# Altium schematic sheet USB.SchDoc: USB-UART & FIFO bridge
size A3; CheckedBy: T.Janicki; CompanyName: Creotech Instruments SA; DrawnBy: Greg Kasprowicz; Organization: CERN; Address1: European Organization for Nuclear Research; Address2: CH-1211 Genève 23 - Switzerland; DocumentNumber: 17; Revision: -; SheetNumber: 17; SheetTotal: 17; EDA_Number: EDA-xxxx; Projet: Simple VME FMC Carrier; CreateDate: 20/11/2012; CheckedDate: 23/01/2012; DivGrp: BE-CO; Designer: G.Kasprowicz; ModifiedDate: -
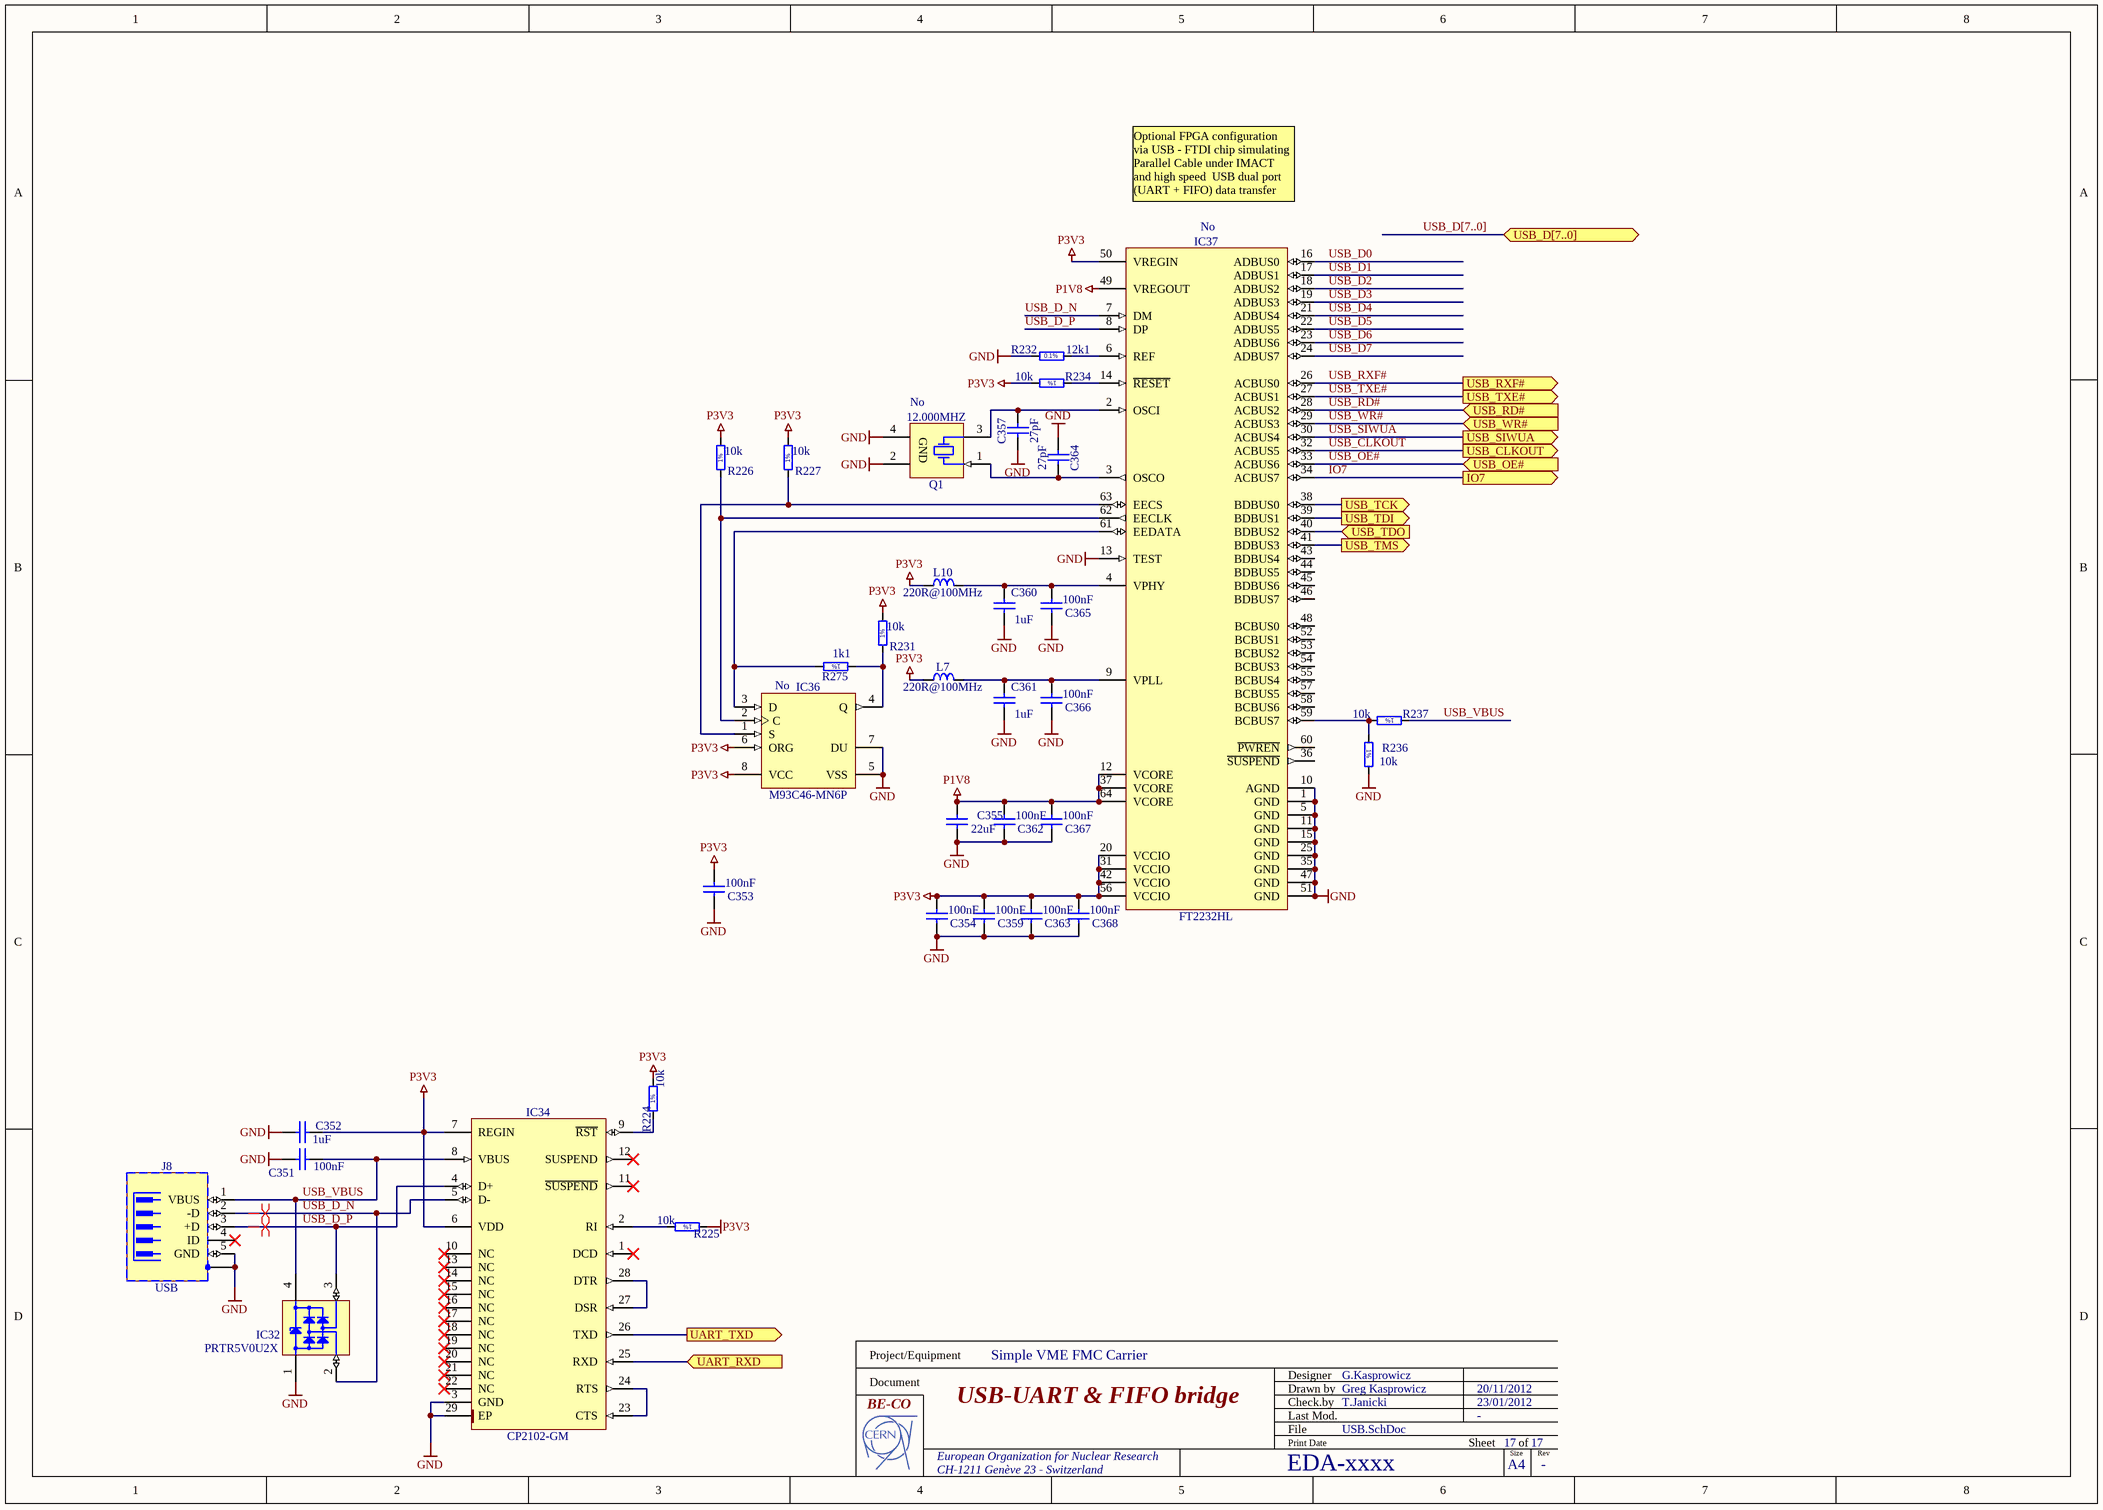
[diagram p0: USB.SchDoc]

## Parts
C351  100nF  [CAPC1005X55N]
C352  1uF  [CAPC1608X87N]
C353  100nF  [CAPC1005X55N]
C354  100nF  [CAPC1005X55N]
C355  22uF  [CAPC3216X180N]
C357  27pF  [CAPC1608X87N]
C359  100nF  [CAPC1005X55N]
C360  1uF  [CAPC1608X87N]
C361  1uF  [CAPC1608X87N]
C362  100nF  [CAPC1005X55N]
C363  100nF  [CAPC1005X55N]
C364  27pF  [CAPC1608X87N]
C365  100nF  [CAPC1005X55N]
C366  100nF  [CAPC1005X55N]
C367  100nF  [CAPC1005X55N]
C368  100nF  [CAPC1005X55N]
IC32  PRTR5V0U2X  [SOT190P230X110-4N]
IC34  CP2102-GM  [QFN50P500X500X100-29N-S335]
IC36  M93C46-MN6P  Mounted: No  [SOIC127P600X175-8N]
IC37  FT2232HL  Mounted: No  [QFP50P1200X1200X160-64N]
J8  USB  [TYCO_1734035-1]
L7  220R@100MHz  [INDC2012X105N]
L10  220R@100MHz  [INDC2012X105N]
Q1  12.000MHZ  Mounted: No  [XTAL_ABRACON_ABM3B]
R224  10k  [RESC1608X55N]
R225  10k  [RESC1608X55N]
R226  10k  [RESC1608X55N]
R227  10k  [RESC1608X55N]
R231  10k  [RESC1608X55N]
R232  12k1  [RESC1608X55N]
R234  10k  [RESC1608X55N]
R236  10k  [RESC1608X55N]
R237  10k  [RESC1608X55N]
R275  1k1  [RESC1608X55N]

## Ports
IO7 (out), UART_RXD (in), UART_TXD (out), USB_CLKOUT (out), USB_D[7..0] (bidir), USB_OE# (in), USB_RD# (in), USB_RXF# (out), USB_SIWUA (out), USB_TCK (out), USB_TDI (out), USB_TDO (in), USB_TMS (out), USB_TXE# (out), USB_WR# (in)

## Nets
GND: C351.2 C352.2 C353.2 C354.2 C355.1 C357.1 C359.2 C360.1 C361.1 C362.2 C363.2 C364.1 C365.2 C366.2 C367.2 C368.2 IC32.1(GND) IC34.3(GND) IC34.29(EP) IC36.5(VSS) IC36.7(DU) IC37.1(GND) IC37.5(GND) IC37.10(AGND) IC37.11(GND) IC37.13(TEST) IC37.15(GND) IC37.25(GND) IC37.35(GND) IC37.47(GND) IC37.51(GND) J8.5(GND) J8.6(SH) Q1.2(GND) Q1.4(GND) R232.1 R236.2
P1V8: C355.2 C362.1 C367.1 IC37.12(VCORE) IC37.37(VCORE) IC37.49(VREGOUT) IC37.64(VCORE)
P3V3: C352.1 C353.1 C354.1 C359.1 C363.1 C368.1 IC34.6(VDD) IC34.7(REGIN) IC36.6(ORG) IC36.8(VCC) IC37.20(VCCIO) IC37.31(VCCIO) IC37.42(VCCIO) IC37.50(VREGIN) IC37.56(VCCIO) L7.1 L10.1 R224.2 R225.1 R226.2 R227.2 R231.2 R234.2
IO7: IC37.34(ACBUS7) ; port IO7
UART_RXD: IC34.25(RXD) ; port UART_RXD
UART_TXD: IC34.26(TXD) ; port UART_TXD
USB_CLKOUT: IC37.32(ACBUS5) ; port USB_CLKOUT
USB_D0: IC37.16(ADBUS0)
USB_D1: IC37.17(ADBUS1)
USB_D2: IC37.18(ADBUS2)
USB_D3: IC37.19(ADBUS3)
USB_D4: IC37.21(ADBUS4)
USB_D5: IC37.22(ADBUS5)
USB_D6: IC37.23(ADBUS6)
USB_D7: IC37.24(ADBUS7)
USB_D_N: IC32.2(I/O1) IC34.5(D-) IC37.7(DM) J8.2(-D)
USB_D_P: IC32.3(I/O2) IC34.4(D+) IC37.8(DP) J8.3(+D)
USB_OE#: IC37.33(ACBUS6) ; port USB_OE#
USB_RD#: IC37.28(ACBUS2) ; port USB_RD#
USB_RXF#: IC37.26(ACBUS0) ; port USB_RXF#
USB_SIWUA: IC37.30(ACBUS4) ; port USB_SIWUA
USB_TCK: IC37.38(BDBUS0) ; port USB_TCK
USB_TDI: IC37.39(BDBUS1) ; port USB_TDI
USB_TDO: IC37.40(BDBUS2) ; port USB_TDO
USB_TMS: IC37.41(BDBUS3) ; port USB_TMS
USB_TXE#: IC37.27(ACBUS1) ; port USB_TXE#
USB_VBUS: C351.1 IC32.4(VCC) IC34.8(VBUS) J8.1(VBUS) R237.1
USB_WR#: IC37.29(ACBUS3) ; port USB_WR#
NetC357_2: C357.2 IC37.2(OSCI) Q1.3(X)
NetC360_2: C360.2 C365.1 IC37.4(VPHY) L10.2
NetC361_2: C361.2 C366.1 IC37.9(VPLL) L7.2
NetC364_2: C364.2 IC37.3(OSCO) Q1.1(X)
NetIC34_2: IC34.2(RI) R225.2
NetIC34_9: IC34.9(~{RST}) R224.1
NetIC34_23: IC34.23(CTS) IC34.24(RTS)
NetIC34_27: IC34.27(DSR) IC34.28(DTR)
NetIC36_1: IC36.1(S) IC37.63(EECS) R227.1
NetIC36_2: IC36.2(C) IC37.62(EECLK) R226.1
NetIC36_3: IC36.3(D) IC37.61(EEDATA) R275.2
NetIC36_4: IC36.4(Q) R231.1 R275.1
NetIC37_6: IC37.6(REF) R232.2
NetIC37_14: IC37.14(~{RESET}) R234.1
NetIC37_59: IC37.59(BCBUS7) R236.1 R237.2

Not connected (* = marked no-connect by the designer): IC34 1(DCD)* 10(NC)* 11(~{SUSPEND})* 12(SUSPEND)* 13(NC)* 14(NC)* 15(NC)* 16(NC)* 17(NC)* 18(NC)* 19(NC)* 20(NC)* 21(NC)* 22(NC)*; IC37 36(~{SUSPEND}) 43(BDBUS4) 44(BDBUS5) 45(BDBUS6) 46(BDBUS7) 48(BCBUS0) 52(BCBUS1) 53(BCBUS2) 54(BCBUS3) 55(BCBUS4) 57(BCBUS5) 58(BCBUS6) 60(~{PWREN}); J8 4(ID)*

## Buses and harness runs
bus USB_D[7..0] = port USB_D[7..0]

## Layout directives
differential pair: USB_D_N, USB_D_P

## Notes on the sheet
- Optional FPGA configuration via USB - FTDI chip simulating Parallel Cable under IMACT and high speed  USB dual port (UART + FIFO) data transfer port
- Project/Equipment
- Document
- Designer
- Drawn by
- Check.by
- File
- Last Mod.
- Print Date
- Sheet
- Size
- A4
- of
- Rev
- (in symbol R0603_1K1_1%_0.1W_100PPM) 1%
- (in symbol R0603_10K_1%_0.1W_100PPM) 1%
- (in symbol R0603_12K1_0.1%_0.063W_10PPM) 0.1%

## Library data of the parts
C351 C353 C354 C359 C362 C363 C365-C368 = CC0402_100NF_16V_10%_X7R: Non-polarised capacitor; Part Description: SMD Multilayer Chip Ceramic Capacitor; Manufacturer: GENERIC; Manufacturer1 Part Number: 223878715649; Voltage: 16V; TC: X7R; Tolerance: ±10%; Table: Capacitors SMD; Part Number: CC0402_100NF_16V_10%_X7R; Component Kind: Standard; Component Type: Standard; Pin Count: 2; Value: 100nF; Status: Not Recommended; Manufacturer Part Number: CC0402_100NF_16V_10%_X7R; Case: 0402; Mounted: Yes; Socket: No; SMD: Yes; Manufacturer1 Example: PHYCOMP; Manufacturer1 ComponentHeight: 0.55mm; HelpURL: \\cern.ch\dfs\Applications\Altium\Datasheets\CC0402_X7R_PHYCOMP.pdf; Author: CERN DEM JLC; CreateDate: 03/12/2007; LatestRevisionDate: 03/12/2007
C352 C360 C361 = CC0603_1UF_16V_10%_X7R: Non-polarised capacitor; Part Description: SMD Multilayer Chip Ceramic Capacitor; Manufacturer: GENERIC; Manufacturer1 Part Number: 223824613663; Voltage: 16V; TC: X7R; Tolerance: ±10%; Table: Capacitors SMD; Part Number: CC0603_1UF_16V_10%_X7R; Component Kind: Standard; Component Type: Standard; Pin Count: 2; Value: 1uF; Status: Preferred; Manufacturer Part Number: CC0603_1uF_16V_10%_X7R; Case: 0603; Mounted: Yes; Socket: No; SMD: Yes; Manufacturer1 Example: PHYCOMP; Manufacturer1 ComponentHeight: 0.87mm; HelpURL: \\cern.ch\dfs\Applications\Altium\Datasheets\CC0805_X5R_PHYCOMP_HC.pdf; Author: CERN DEM JLC
  C352: CreateDate: 12/3/2007; LatestRevisionDate: 12/3/2007
  C360 C361: CreateDate: 03/12/2007; LatestRevisionDate: 03/12/2007
C355 = CC1206_22UF_10V_10%_X7R: Non-polarised capacitor; Part Description: SMD Multilayer Chip Ceramic Capacitor; Manufacturer: GENERIC; Manufacturer1 Part Number: GRM31CR71A226KE15L; Voltage: 10V; TC: X7R; Tolerance: ±10%; Table: Capacitors SMD; Part Number: CC1206_22UF_10V_10%_X7R; Component Kind: Standard; Component Type: Standard; Pin Count: 2; Value: 22uF; Status: Preferred; Manufacturer Part Number: CC1206_22UF_10V_10%_X7R; Case: 1206; Mounted: Yes; Socket: No; SMD: Yes; Manufacturer1 Example: MURATA; Manufacturer1 ComponentHeight: 1.8mm; HelpURL: \\cern.ch\dfs\Applications\Altium\Datasheets\CC1206_X7R_MURATA_GRM-HI-CAP.pdf; Author: CERN DEM JLC; CreateDate: 2010-06-08; LatestRevisionDate: 2010-06-08
C357 C364 = CC0603_27PF_50V_5%_NP0: Non-polarised capacitor; Part Description: SMD Multilayer Chip Ceramic Capacitor; Manufacturer: GENERIC; Manufacturer1 Part Number: 223886715279; Voltage: 50V; TC: NP0; Tolerance: ±5%; Table: Capacitors SMD; Part Number: CC0603_27PF_50V_5%_NP0; Component Kind: Standard; Component Type: Standard; Pin Count: 2; Value: 27pF; Status: Preferred; Manufacturer Part Number: CC0603_27PF_50V_5%_NP0; Case: 0603; Mounted: Yes; Socket: No; SMD: Yes; Manufacturer1 Example: PHYCOMP; Manufacturer1 ComponentHeight: 0.87mm; HelpURL: \\cern.ch\dfs\Applications\Altium\Datasheets\CC0603_NP0_PHYCOMP.pdf; Author: CERN DEM JLC; CreateDate: 2007-12-03; LatestRevisionDate: 2007-12-03
IC32 = PRTR5V0U2X: Ultra Low Capacitance Double Rail-to-Rail ESD Protection Diode; Part Description: Ultra Low Capacitance (1pF) Double Rail-to-Rail ESD Protection Diode (8kV); Manufacturer: PHILIPS NXP; Voltage: 5.5V; Table: Diodes; Part Number: PRTR5V0U2X; Component Kind: Standard; Component Type: Standard; Device: PRTR5V0U2X; PackageDescription: SOT143B, SOT, 1.90mm Pitch; 4 Pin, 1.30mm W X 2.90mm L X 1.10mm H body, IPC Medium Density; Manufacturer Part Number: PRTR5V0U2X; Pin Count: 4; Case: SOT143B; Mounted: Yes; Socket: No; SMD: Yes; ComponentHeight: 1.1mm; HelpURL: \\cern.ch\dfs\Applications\Altium\Datasheets\PRTR5V0U2X.pdf; Author: CERN DEM JLC; CreateDate: 3/22/2011; LatestRevisionDate: 3/22/2011
IC34 = CP2102-GM: Single-Chip USB to UART Bridge; Manufacturer: SILICON LABS; Table: Analog & Interface; Part Number: CP2102-GM; Component Kind: Standard; Component Type: Standard; Device: CP2102-GM; PackageDescription: QFN, 0.50mm Pitch, Square; 28 pin, 5.00mm L X 5.00mm W X 1.00mm H body (w/thermal tab 3.35 X 3.35mm),  IPC Medium Density; Part Description: Single-Chip USB to UART Bridge; Manufacturer Part Number: CP2102-GM; Pin Count: 29; Case: QFN28; Mounted: Yes; Socket: No; SMD: Yes; ComponentHeight: 1.0mm; Author: CERN DEM JLC; HelpURL: \\cern.ch\dfs\Applications\Altium\Datasheets\CP2102-GM.pdf; CreateDate: 3/3/2011; LatestRevisionDate: 3/3/2011
IC36 = M93C46-MN6P: 1Kb (x8/x16) Serial Microwire Bus EEPROM; Part Description: 1K (128 x 8 or 64 x 16 bit) Serial Microwire Bus EEPROM; Manufacturer: ST MICROELECTRONICS; Table: Logic; Part Number: M93C46-MN6P; Component Kind: Standard; Component Type: Standard; Device: M93C46-MN6P; PackageDescription: SOIC 8, Pitch 1.27mm - Body 4x5mm, IPC Medium Density; Manufacturer Part Number: M93C46-MN6P; Pin Count: 8; Case: SOIC8; Socket: No; SMD: Yes; ComponentHeight: 1.75mm; HelpURL: \\cern.ch\dfs\Applications\Altium\Datasheets\M93C46-MN6P.pdf; Author: CERN DEM JLC; CreateDate: 2008-09-09; LatestRevisionDate: 2008-09-09
IC37 = FT2232HL: Dual High Speed USB to Multipurpose UART/FIFO IC; Manufacturer: FUTURE TECHNOLOGY DEVICES INTERNATIONAL (FTDI); Table: Analog & Interface; Part Number: FT2232HL; Component Kind: Standard; Component Type: Standard; Device: FT2232HL; PackageDescription: QFP, 0.50mm pitch, square; 16 pin X 16 pin, 10.00mm X 10.00mm X 1.60mm Body, IPC Medium Density; Part Description: Dual High Speed USB to Multipurpose UART/FIFO IC; Manufacturer Part Number: FT2232HL; Pin Count: 64; Case: QFP64; Socket: No; SMD: Yes; ComponentHeight: 1.6mm; Author: CERN DEM JLC; HelpURL: \\cern.ch\dfs\Applications\Altium\Datasheets\FT2232HL.pdf; CreateDate: 2011-12-06; LatestRevisionDate: 2011-12-06
J8 = TYCO_1734035-1: 5 Pin + 1 Shield USB Receptacle; Part Description: 5 Position, Right Angle, SMD Mini USB Type B Receptacle; Manufacturer: TYCO ELECTRONICS; Table: TYCO; Part Number: TYCO_1734035-1; Component Kind: Standard; Component Type: Standard; Pin Count: 6; Family: USB; Mounted: Yes; Socket: No; SMD: Yes; Status: None; Manufacturer Part Number: 1734035-1; ComponentHeight: 3.95mm; HelpURL: \\cern.ch\dfs\Applications\Altium\Datasheets\TYCO_1734035-1.pdf; Author: CERN DEM JLC; CreateDate: 02/05/2011; LatestRevisionDate: 02/05/2011
L7 L10 = IND0805_MURATA_BLM21PG221SN1D: Inductor; Part Description: SMD EMIFIL Suppression Chip Bead Ferrite; Manufacturer: MURATA; Power: 2A; Resistance: 0.05R; Tolerance: ±25%; Table: Inductors SMD; Part Number: IND0805_MURATA_BLM21PG221SN1D; Component Kind: Standard; Component Type: Standard; Pin Count: 2; Value: 220R@100MHz; Status: None; Manufacturer Part Number: BLM21PG221SN1D; Case: 0805; Mounted: Yes; Socket: No; SMD: Yes; ComponentHeight: 1.05mm; HelpURL: \\cern.ch\dfs\Applications\Altium\Datasheets\IND0402_MURATA_BLM21P.pdf; Author: CERN DEM JLC; CreateDate: 25/01/2010; LatestRevisionDate: 25/01/2010
Q1 = XTAL_18.432MHZ_ABRACON_ABM3B-18.432MHZ-B2-T: Crystal 4 pins 1=XTAL Control 2=GND3=XTAL 4=GND; Part Number: XTAL_12.000MHZ_ABRACON_ABM3B-12.000MHZ-B2-T; Part Description: Tolerance:± 20ppm, Stability:± 50ppm, -20°C to +70°C, 18pF, Ceramic SMD Crystal, ABM3B Serie; Manufacturer Part Number: ABM3B-12.000MHZ-B2-T; Table: Crystals & Oscillators; Component Kind: Standard; Component Type: Standard; PackageDescription: ABM3B Serie, SMD Cristal, Body 5.x3.2mm; Value: 12.000MHZ; Manufacturer: ABRACON; Pin Count: 2; Socket: No; SMD: Yes; ComponentHeight: 1.1mm; HelpURL: \\cern.ch\dfs\Applications\Altium\Datasheets\XTAL_ABRACON_ABM3B.pdf; Author: CERN DEM JLC; CreateDate: 2012-01-09; LatestRevisionDate: 2012-01-09
R224-R227 R231 R234 R236 R237 = R0603_10K_1%_0.1W_100PPM: Resistor - 1%; Part Description: General Purpose Thick Film Chip Resistor; Manufacturer: GENERIC; Manufacturer1 Part Number: NRC06F1002TRF; Power: 0.1W; TC: ±100ppm/°C; Table: Resistors SMD; Part Number: R0603_10K_1%_0.1W_100PPM; Component Kind: Standard; Component Type: Standard; Pin Count: 2; Value: 10k; Status: Preferred; Tolerance: ±1%; Manufacturer Part Number: R0603_10K_1%_0.1W_100PPM; Case: 0603; Mounted: Yes; Socket: No; SMD: Yes; Manufacturer1 Example: NIC COMPONENT; Manufacturer1 ComponentHeight: 0.55mm; HelpURL: \\cern.ch\dfs\Applications\Altium\Datasheets\R0603_NIC_NRC.pdf; Author: CERN DEM JLC; CreateDate: 12/3/2007; LatestRevisionDate: 3/13/2008
R232 = R0603_12K1_0.1%_0.063W_10PPM: Resistor - 0.1%; Part Description: Thin Film Chip Resistor; Manufacturer: GENERIC; Manufacturer1 Part Number: RN73C1J12K1BTDF; Power: 0.063W; TC: ±10ppm; Table: Resistors SMD; Part Number: R0603_12K1_0.1%_0.063W_10PPM; Component Kind: Standard; Component Type: Standard; Pin Count: 2; Value: 12k1; Status: Not recommended; Tolerance: ±0.1%; Manufacturer Part Number: R0603_12K1_0.1%_0.063W_10PPM; Case: 0603; Mounted: Yes; Socket: No; SMD: Yes; Manufacturer1 Example: TYCO HOLSWORTHY; Manufacturer1 ComponentHeight: 0.5mm; HelpURL: \\cern.ch\dfs\Applications\Altium\Datasheets\R0603_Tyco_RN73.pdf; Author: CERN DEM JLC; CreateDate: 2007-12-03; LatestRevisionDate: 2008-03-13
R275 = R0603_1K1_1%_0.1W_100PPM: Resistor - 1%; Part Description: General Purpose Thick Film Chip Resistor; Manufacturer: GENERIC; Manufacturer1 Part Number: NRC06F1101TRF; Power: 0.1W; TC: ±100ppm/°C; Table: Resistors SMD; Part Number: R0603_1K1_1%_0.1W_100PPM; Component Kind: Standard; Component Type: Standard; Pin Count: 2; Value: 1k1; Status: Preferred; Tolerance: ±1%; Manufacturer Part Number: R0603_1K1_1%_0.1W_100PPM; Case: 0603; Mounted: Yes; Socket: No; SMD: Yes; Manufacturer1 Example: NIC COMPONENT; Manufacturer1 ComponentHeight: 0.55mm; HelpURL: \\cern.ch\dfs\Applications\Altium\Datasheets\R0603_NIC_NRC.pdf; Author: CERN DEM JLC; CreateDate: 2007-12-03; LatestRevisionDate: 2008-03-13